# EAGLE design motor_driver (EAGLE 7.1.0)
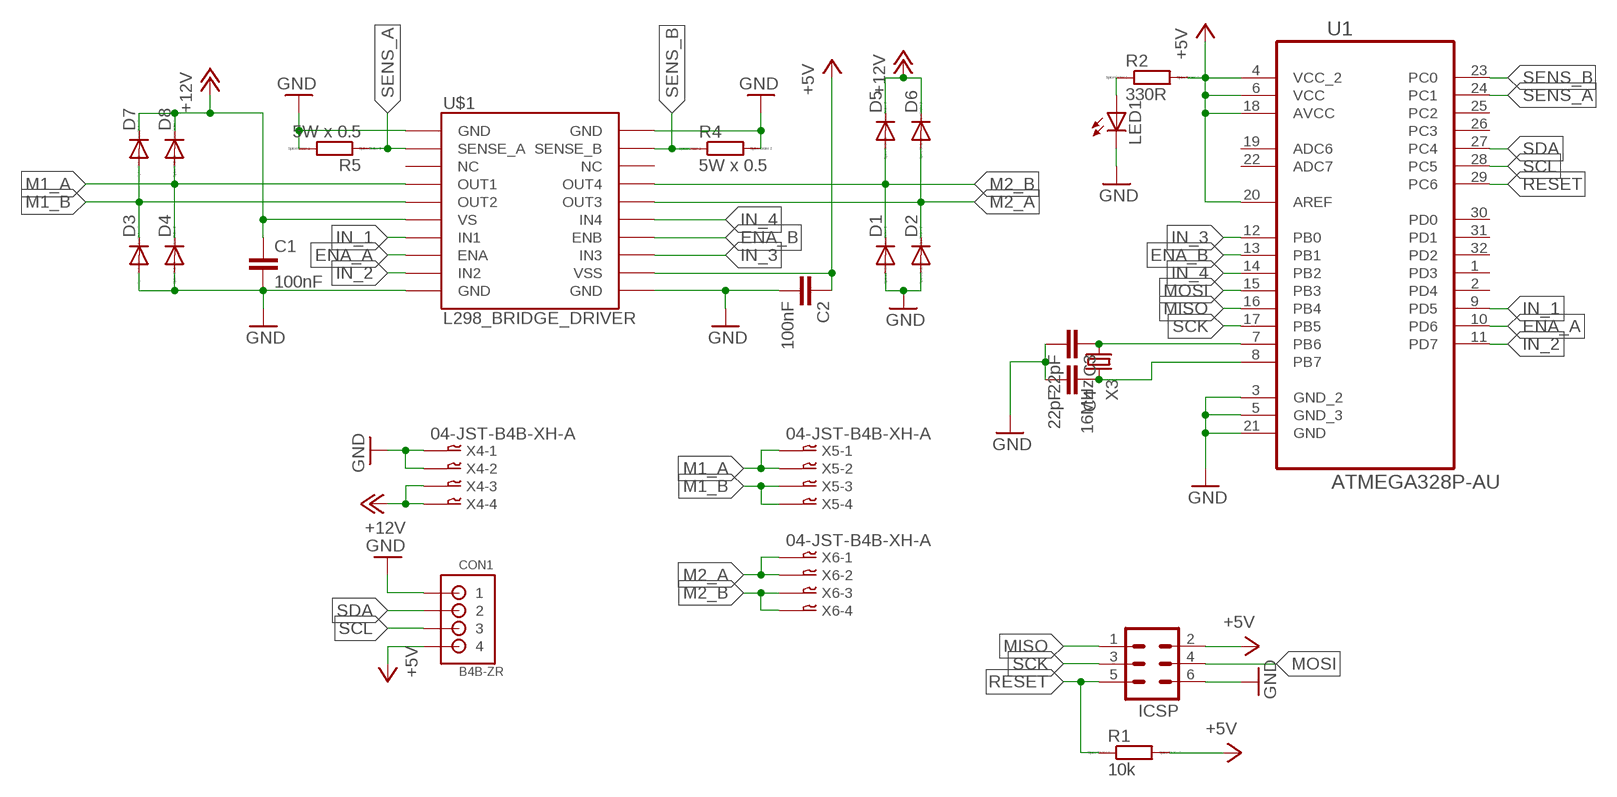
[diagram p0: schematic, sheet 1]

## Parts
C1  100nF  C-EUC1206K  [C1206K]
C2  100nF  C-EUC1206K  [C1206K]
C3  22pF  C-EUC1206K  [C1206K]
C4  22pF  C-EUC1206K  [C1206K]
CON1  B4B-ZR  [B4B-ZR]
D1  DIODE-SMC  [SMC]
D2  DIODE-SMC  [SMC]
D3  DIODE-SMC  [SMC]
D4  DIODE-SMC  [SMC]
D5  DIODE-SMC  [SMC]
D6  DIODE-SMC  [SMC]
D7  DIODE-SMC  [SMC]
D8  DIODE-SMC  [SMC]
ICSP  MA03-2  [MA03-2]
LED1  LEDCHIPLED_1206  [CHIPLED_1206]
R1  10k  R-EU_M3216  [M3216]
R2  330R  R-EU_M3216  [M3216]
R4  5W x 0.5  R-EU_RWS5  [R6332]
R5  5W x 0.5  R-EU_RWS5  [R6332]
U1  ATMEGA328P-AU  [QFP80P900X900X120-32N]
U$1  L298_BRIDGE_DRIVER  [POWERSO20]
X3  16MHz  CRYSTALS-NOGND-12SMX-A  [7.5X5-2-PAD]
X4  04-JST-B4B-XH-A  [B4B-XH]
X5  04-JST-B4B-XH-A  [B4B-XH]
X6  04-JST-B4B-XH-A  [B4B-XH]

## Nets
+5V: C2.1 CON1.4 ICSP.2 R1.2 R2.2 U1.4(VCC_2) U1.6(VCC) U1.18(AVCC) U1.20(AREF) U$1.12(VSS)
+12V: C1.1 D5.C D6.C D7.C D8.C U$1.6(VS) X4.P$3
ENA_A: U1.10(PD6) U$1.8(ENA)
ENA_B: U1.13(PB1) U$1.14(ENB)
GND: C1.2 C2.2 C3.2 C4.2 CON1.1 D1.A D2.A D3.A D4.A ICSP.6 LED1.C R4.P$2 R5.P$2 U1.3(GND_2) U1.5(GND_3) U1.21(GND) U$1.1(GND) U$1.10(GND) U$1.11(GND) U$1.20(GND) X4.P$2
IN_1: U1.9(PD5) U$1.7(IN1)
IN_2: U1.11(PD7) U$1.9(IN2)
IN_3: U1.12(PB0) U$1.13(IN3)
IN_4: U1.14(PB2) U$1.15(IN4)
M1_A: D4.C D8.A U$1.4(OUT1) X5.P$1 X5.P$2
M1_B: D3.C D7.A U$1.5(OUT2) X5.P$3 X5.P$4
M2_A: D2.C D6.A U$1.16(OUT3) X6.P$1 X6.P$2
M2_B: D1.C D5.A U$1.17(OUT4) X6.P$3 X6.P$4
MISO: ICSP.1 U1.16(PB4)
MOSI: ICSP.4 U1.15(PB3)
N$1: LED1.A R2.1
N$5: C4.1 U1.8(PB7) X3.2
N$6: C3.1 U1.7(PB6) X3.1
RESET: ICSP.5 R1.1 U1.29(PC6)
SCK: ICSP.3 U1.17(PB5)
SCL: CON1.3 U1.28(PC5)
SDA: CON1.2 U1.27(PC4)
SENS_A: R5.P$1 U1.24(PC1) U$1.2(SENSE_A)
SENS_B: R4.P$1 U1.23(PC0) U$1.19(SENSE_B)
Unconnected: U1.1(PD3) U1.2(PD4) U1.19(ADC6) U1.22(ADC7) U1.25(PC2) U1.26(PC3) U1.30(PD0) U1.31(PD1) U1.32(PD2) U$1.3(NC) U$1.18(NC) X4.P$1 X4.P$4

## Library data of the parts
C1-C4 = rcl:C-EU: CAPACITOR, European symbol
CON1 = jst:B4B-ZR: JST-ZH Connector 4 pol, 1.5mm pitch Package: B4B-ZR Source: http://www.jst-mfg.com/product/pdf/eng/eZH.pdf
D1-D8 = diode:DIODE-: DIODE
ICSP = con-lstb:MA03-2: PIN HEADER; OC_FARNELL: unknown; OC_NEWARK: unknown
LED1 = led:LED: LED OSRAM: - CHIPLED LG R971, LG N971, LY N971, LG Q971, LY Q971, LO R971, LY R971 LH N974, LH R974 LS Q976, LO Q976, LY Q976 LO Q996 - Hyper CHIPLED LW Q18S LB Q993, LB Q99A, LB R99A - SideLED LS A670, LO A670, LY A670, LG A670, LP A670 LB A673, LV A673, LT A673, LW A673 LH A674 LY A675 LS A676, LA A676, LO A676, LY A676, LW A676 LS A679, LY A679, LG A679 - Hyper Micro SIDELED® LS Y876, LA Y876, LO Y876, LY Y876 LT Y87S - SmartLED LW L88C, LW L88S LB L89C, LB L89S, LG L890 LS L89K, LO L89K, LY L89K LS L896, LA L896, LO L896, LY L896 - TOPLED LS T670, LO T670, LY T670, LG T670, LP T670 LSG T670, LSP T670, LSY T670, LOP T670, LYG T670 LG T671, LOG T671, LSG T671 LB T673, LV T673, LT T673, LW T673 LH T674 LS T676, LA T676, LO T676, LY T676, LB T676, LH T676, LSB T676, LW T676 LB T67C, LV T67C, LT T67C, LS T67K, LO T67K, LY T67K, LW E67C LS E67B, LA E67B, LO E67B, LY E67B, LB E67C, LV E67C, LT E67C LW T67C LS T679, LY T679, LG T679 LS T770, LO T770, LY T770, LG T770, LP T770 LB T773, LV T773, LT T773, LW T773 LH T774 LS E675, LA E675, LY E675, LS T675 LS T776, LA T776, LO T776, LY T776, LB T776 LHGB T686 LT T68C, LB T68C - Hyper Mini TOPLED® LB M676 - Mini TOPLED Santana® LG M470 LS M47K, LO M47K, LY M47K Source: http://www.osram.convergy.de LUXEON: - LUMILED® LXK2-PW12-R00, LXK2-PW12-S00, LXK2-PW14-U00, LXK2-PW14-V00 LXK2-PM12-R00, LXK2-PM12-S00, LXK2-PM14-U00 LXK2-PE12-Q00, LXK2-PE12-R00, LXK2-PE12-S00, LXK2-PE14-T00, LXK2-PE14-U00 LXK2-PB12-K00, LXK2-PB12-L00, LXK2-PB12-M00, LXK2-PB14-N00, LXK2-PB14-P00, LXK2-PB14-Q00 LXK2-PR12-L00, LXK2-PR12-M00, LXK2-PR14-Q00, LXK2-PR14-R00 LXK2-PD12-Q00, LXK2-PD12-R00, LXK2-PD12-S00 LXK2-PH12-R00, LXK2-PH12-S00 LXK2-PL12-P00, LXK2-PL12-Q00, LXK2-PL12-R00 Source: www.luxeon.com KINGBRIGHT: KA-3528ASYC Source: www.kingbright.com
R1 R2 = resistor:R-EU_: RESISTOR, European symbol; SPICEPREFIX: R
R4 R5 = robocup:R-EU_: RESISTOR, European symbol
U1 = Atmel_By_element14_Batch_1-00:ATMEGA328P-AU: 8-bit Microcontroller with In-System Programmable Flash; MPN: ATMEGA328P-AU; OC_FARNELL: 1715486; OC_NEWARK: 14R4631; PACKAGE: TQFP-32; SUPPLIER: Atmel
U$1 = SparkFun-PowerIC:L298_BRIDGE_DRIVER: Full-bridge power driver IC
X3 = IQD-Frequency-Products:CRYSTALS-NOGND: CRYSTALS CAN NOT GROUNDED
X4-X6 = bt_con-jst-xh:04-JST: JST CONNECTOR

## Board
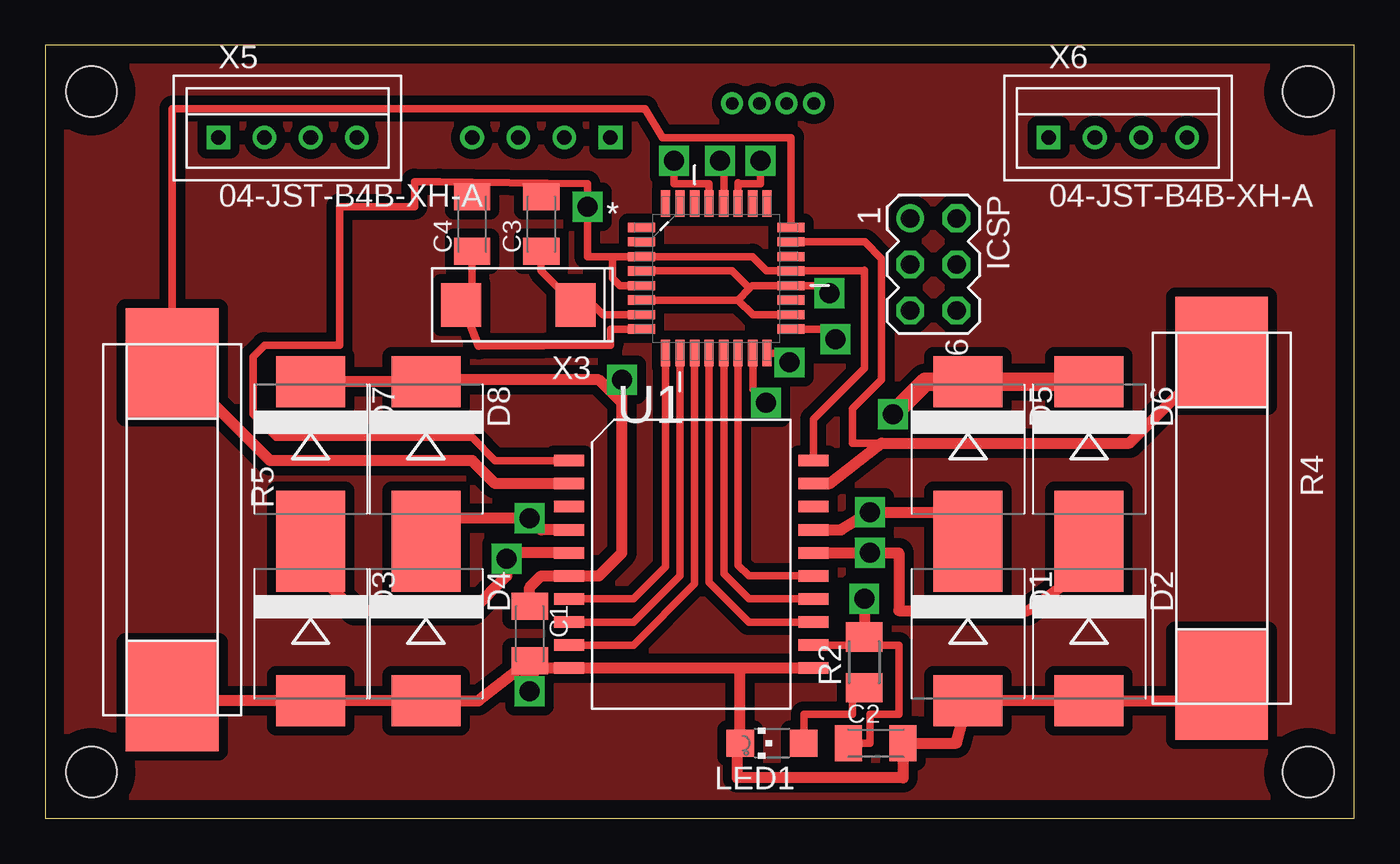
[diagram p1: board, top side]
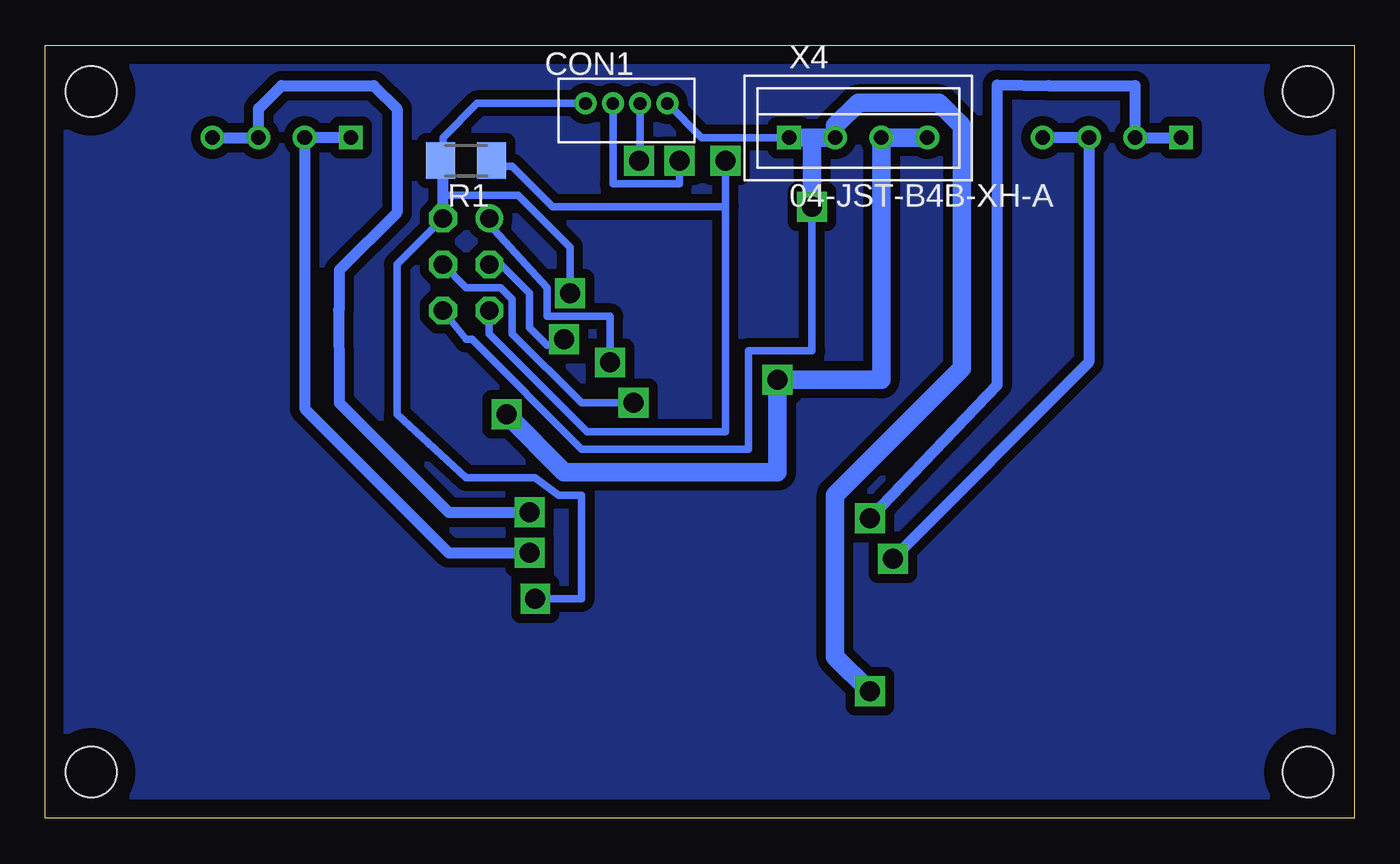
[diagram p2: board, bottom side, seen from below]

Size 72.06 x 42.53 mm. Coordinates in mm from the lower left corner, seen from the top.
Outline: 0,0 72.06,0 72.06,42.53 0,42.53 0,0
Copper layers (1*16): Top 0.035mm / dielectric 1.5mm / Bottom 0.035mm
Design rules "default *": minimum track width 10mil, minimum drill 24mil, track to track 20mil, track to pad 20mil, pad to pad 8mil, via to via 8mil, smd to smd 20mil, copper to edge 40mil, drill to drill 8mil, minimum pad ring 10mil, minimum via ring 8mil, stop-mask expansion 4mil, vias tented up to drill 0mil, thermal gap 10mil
Holes 2.8 mm at 2.54,40.01 69.53,40.01 69.53,2.54 2.54,2.54

### Footprints (pad centres in the part's own frame; a part is rotated, then mirrored left to right if it is on the bottom)
C1206K = smd 1.5 x 2: 1 -1.5,0; 2 1.5,0
B4B-ZR = drill 0.7: 1 6,-1.3; 2 4.5,-1.3; 3 3,-1.3; 4 1.5,-1.3
SMC = smd 2.8 x 3.8: A 3.7,0; C -3.7,0
MA03-2 = drill 1.016: 1 -2.54,-1.27 | drill 1.016 octagon: 2 -2.54,1.27; 3 0,-1.27; 4 0,1.27; 5 2.54,-1.27; 6 2.54,1.27
CHIPLED_1206 = smd 1.5 x 1.5: A 0,-1.75; C 0,1.75
M3216 = smd 1.6 x 2: 1 -1.4,0; 2 1.4,0
R6332 = smd 6 x 5.1: P$1 -9.2,0; P$2 9.2,0
QFP80P900X900X120-32N = smd 1.473 x 0.508: 1 -4.115,2.794; 2 -4.115,2.007; 3 -4.115,1.194; 4 -4.115,0.406; 5 -4.115,-0.406; 6 -4.115,-1.194; 7 -4.115,-2.007; 8 -4.115,-2.794; 17 4.115,-2.794; 18 4.115,-2.007; 19 4.115,-1.194; 20 4.115,-0.406; 21 4.115,0.406; 22 4.115,1.194; 23 4.115,2.007; 24 4.115,2.794 | smd 0.508 x 1.473: 9 -2.794,-4.115; 10 -2.007,-4.115; 11 -1.194,-4.115; 12 -0.406,-4.115; 13 0.406,-4.115; 14 1.194,-4.115; 15 2.007,-4.115; 16 2.794,-4.115; 25 2.794,4.115; 26 2.007,4.115; 27 1.194,4.115; 28 0.406,4.115; 29 -0.406,4.115; 30 -1.194,4.115; 31 -2.007,4.115; 32 -2.794,4.115
POWERSO20 = smd 1.651 x 0.635: 1 -6.731,5.715; 2 -6.731,4.445; 3 -6.731,3.175; 4 -6.731,1.905; 5 -6.731,0.635; 6 -6.731,-0.635; 7 -6.731,-1.905; 8 -6.731,-3.175; 9 -6.731,-4.445; 10 -6.731,-5.715; 11 6.731,-5.715; 12 6.731,-4.445; 13 6.731,-3.175; 14 6.731,-1.905; 15 6.731,-0.635; 16 6.731,0.635; 17 6.731,1.905; 18 6.731,3.175; 19 6.731,4.445; 20 6.731,5.715
7.5X5-2-PAD = smd 2.2 x 2.4: 1 -3.15,0; 2 3.15,0
B4B-XH = drill 0.8 square: P$1 -3.81,0 | drill 0.8: P$2 -1.27,0; P$3 1.27,0; P$4 3.81,0

### Placement (x,y rotation side)
C1  26.67,10.16 270 top
C2  45.72,4.13 0 top
C3  27.3,32.7 90 top
C4  23.5,32.7 90 top
CON1  43.81,40.64 0 bottom
D1  50.8,10.16 270 top
D2  57.47,10.16 270 top
D3  14.61,10.16 270 top
D4  20.95,10.16 270 top
D5  50.8,20.32 270 top
D6  57.47,20.32 270 top
D7  14.61,20.32 270 top
D8  20.95,20.32 270 top
ICSP  48.9,30.48 270 top
LED1  40.01,4.13 90 top
R1  48.9,36.2 180 bottom
R2  45.09,8.57 90 top
R4  64.77,16.51 270 top
R5  6.99,15.88 270 top
U1  36.95,29.71 0 top
U$1  35.56,13.97 0 top
X3  26.04,28.26 180 top
X4  27.3,37.47 0 bottom
X5  13.34,37.47 0 top
X6  59.05,37.47 0 top

### Tracks (layer width: path | path; a pad name or v marks a point on that pad's centre or on a via)
+5V  (via drill 1.1)
  Top 0.406: 38.14,28.52 U1.6 33.06,28.52 33.13,28.45 | 38.14,28.52 38.95,27.71 U1.18 | 38.77,29.16 38.93,29.31 U1.20 42.55,29.31 v43.18,28.89 | 38.77,29.16 38.14,28.52 | U1.4 37.81,30.12 38.77,29.16 | U$1.12 44.64,9.53 R2.2 45.09,9.53 46.99,9.53 46.99,5.71 45.4,5.71 45.4,4.13 C2.1
  Top 0.61: v45.09,12.06 R2.2
  Bottom 0.406: CON1.4 48.29,39.34 50.16,37.47 50.16,36.33 R1.2 | ICSP.2 52.7,30.48 52.7,22.23 48.9,18.73 45.09,18.73 43.81,17.78 42.55,17.78 42.55,12.06 v45.09,12.06 | v43.18,28.89 43.18,31.43 46.04,34.29 50.16,34.29
  Bottom 0.61: ICSP.2 50.16,34.29 50.16,36.06 R1.2
+12V  (via drill 1.1)
  Top 0.61: C1.1 26.67,12.7 27.3,13.34 U$1.6 30.48,13.34 31.75,14.61 31.75,22.86 | D7.C D8.C 21.07,24.13 30.48,24.13 31.75,22.86 | 31.75,22.86 v31.75,24.13
  Top 1.016: D6.C D5.C 48.47,24.02 v46.67,22.23
  Bottom 1.016: 23.5,37.47 X4.P$3 26.04,24.13 v31.75,24.13 31.75,19.05 43.5,19.05 v46.67,22.23
ENA_A
  Top 0.406: U$1.8 32.38,10.79 34.94,13.35 U1.10
ENA_B
  Top 0.406: U1.13 37.35,13.45 38.73,12.06 U$1.14
GND  (via drill 1.1)
  Top 0.406: 31.23,30.91 U1.3 38.93,30.91 39.71,30.12 U1.21 45.09,30.12 | U1.5 31.64,29.31 31.23,29.71 31.23,30.91 | U$1.1 24.77,19.68 23.5,20.95 12.7,20.95 11.43,22.23 11.43,25.4 12.06,26.04 16.19,26.04 16.19,33.66 20.32,33.66 20.32,35.04 21.7,35.04 23.5,35.01 | 31.23,30.91 29.84,30.91 v29.84,33.66 29.84,34.92 27.63,34.95 | 27.63,34.95 23.5,35.01 | U$1.20 42.29,21.97 45.09,24.77 45.09,30.12 | 45.09,30.12 45.09,30.16 | C4.2 23.5,35.01 | C3.2 27.3,34.63 27.63,34.95
  Top 0.61: D1.A D2.A 63.28,6.46 R4.P$2 | R5.P$2 7.2,6.46 D3.A D4.A 23.84,6.46 C1.2 27.07,8.26 U$1.10 38.26,8.26 | U$1.11 38.26,8.26 | D1.A 49.87,6.46 | 38.26,8.26 LED1.C 38.1,4.13 38.1,2.22 47.22,2.22 C2.2 50.16,4.13 D1.A
  Top 1.016: C1.2 v26.67,6.99
  Bottom 0.406: 31.11,37.47 35.94,37.47 CON1.1 | ICSP.6 48.9,26.35 48.58,26.35 42.55,20.32 33.34,20.32 33.34,25.72 29.84,25.72 v29.84,33.66
  Bottom 1.016: 29.84,37.47 X4.P$2 28.57,38.1 27.3,39.37 22.86,39.37 21.59,38.1 21.59,24.77 28.57,17.78 28.57,8.89 v26.67,6.99 | 31.11,37.47 29.84,37.47 | 29.84,37.47 v29.84,33.66
IN_1
  Top 0.406: U$1.7 32.38,12.06 34.15,13.83 U1.9
IN_2
  Top 0.406: U$1.9 32.38,9.53 35.75,12.89 U1.11
IN_3
  Top 0.406: U1.12 36.54,12.99 38.73,10.79 U$1.13
IN_4
  Top 0.406: U1.14 38.14,13.93 38.73,13.34 U$1.15
M1_A  (via drill 1.1)
  Top 0.61: 21.07,15.88 D8.A | D4.C D8.A | U$1.4 27.3,15.88 v26.67,16.51 21.07,16.51 D8.A
  Bottom 0.61: v26.67,16.51 19.64,23.85 19.64,40.36 16.83,40.32 12.06,40.32 X5.P$2 X5.P$1
M1_B  (via drill 1.1)
  Top 0.61: D7.A D3.C 17.04,11.43 23.5,11.43 25.4,13.34 v25.4,14.29 25.72,14.61 U$1.5
  Bottom 0.61: v25.4,14.29 14.61,25.08 X5.P$3 X5.P$4
M2_A  (via drill 1.1)
  Top 0.61: D6.A D2.C 54.09,11.43 46.99,11.43 46.99,14.61 v45.4,14.61 U$1.16
  Bottom 0.61: v45.4,14.61 49.85,14.61 57.78,22.54 X6.P$2 X6.P$1
M2_B  (via drill 1.1)
  Top 0.61: D1.C D5.A 50.37,16.83 v45.4,16.83 43.81,15.88 U$1.17
  Bottom 0.61: v45.4,16.83 49.85,16.83 55.88,22.86 55.88,23.81 55.92,27.98 55.88,28.02 55.88,30.16 52.7,33.34 52.7,39.05 53.98,40.32 59.05,40.32 60.33,39.05 X6.P$3 X6.P$4
MISO  (via drill 1.1)
  Top 0.406: U1.16 40.76,25.6 v40.96,25.08
  Bottom 0.406: v40.96,25.08 40.96,27.62 44.45,27.62 44.45,29.21 47.62,32.7 ICSP.1
MOSI  (via drill 1.1)
  Top 0.406: U1.15 38.95,23.6 v39.69,22.86
  Bottom 0.406: ICSP.4 48.9,29.21 46.99,29.21 46.35,28.57 46.35,26.67 42.55,22.86 v39.69,22.86
N$1
  Top 0.406: LED1.A 41.76,5.71 44.45,5.71 44.45,6.67 R2.1
N$5
  Top 0.406: U1.8 31.11,26.92 31.11,26.04 23.86,25.97 23.06,28.04 23.06,29.07 X3.2 23.5,28.87 C4.1
N$6
  Top 0.406: U1.7 30.7,27.71 29.64,28.76 29.64,29.17 29.55,29.17 X3.1 27.3,30.14 C3.1
N$10
  pour Bottom: 0,42.55 72.07,42.55 72.07,0 0,0
N$11
  pour Top: 0,42.55 72.07,42.55 72.07,0 0,0
RESET  (via drill 1.1)
  Top 0.406: U1.29 36.54,34.92 34.61,34.92 v34.61,36.2
  Bottom 0.406: ICSP.5 47.62,26.67 42.23,21.27 34.61,21.27 34.61,33.66 | 34.61,33.66 v34.61,36.2 | R1.1 47.49,36.06 47.31,35.88 46.35,35.88 44.13,33.66 34.61,33.66
SCK  (via drill 1.1)
  Top 0.406: U1.17 43.43,26.92 v43.5,26.35
  Bottom 0.406: ICSP.3 46.99,30.48 45.4,28.89 45.4,26.99 44.45,26.04 v43.5,26.35
SCL  (via drill 1.1)
  Top 0.406: U1.28 37.35,36.08 v37.15,36.2
  Bottom 0.406: v37.15,36.2 37.15,34.92 40.81,34.92 CON1.3
SDA  (via drill 1.1)
  Top 0.406: U1.27 38.14,34.92 | 38.14,34.96 38.14,34.92 | 38.14,34.92 39.37,34.92 v39.37,36.2
  Bottom 0.406: CON1.2 39.31,36.25 v39.37,36.2
SENS_A
  Top 0.406: U1.24 41.06,37.47 33.97,37.47 33.02,39.05 6.99,39.05 R5.P$1
  Top 0.61: U$1.2 24.77,18.41 23.5,19.68 12.38,19.68 R5.P$1
SENS_B
  Top 0.406: 46.04,20.64 44.45,20.64 44.45,22.54 46.04,24.13 46.04,30.8 45.11,31.72 U1.23
  Top 0.61: U$1.19 43.18,18.41 46.04,20.64 59.7,20.64 R4.P$1